# Altium project ZYNQ_JTY_16CH.PrjPcb (part 2 of 2)
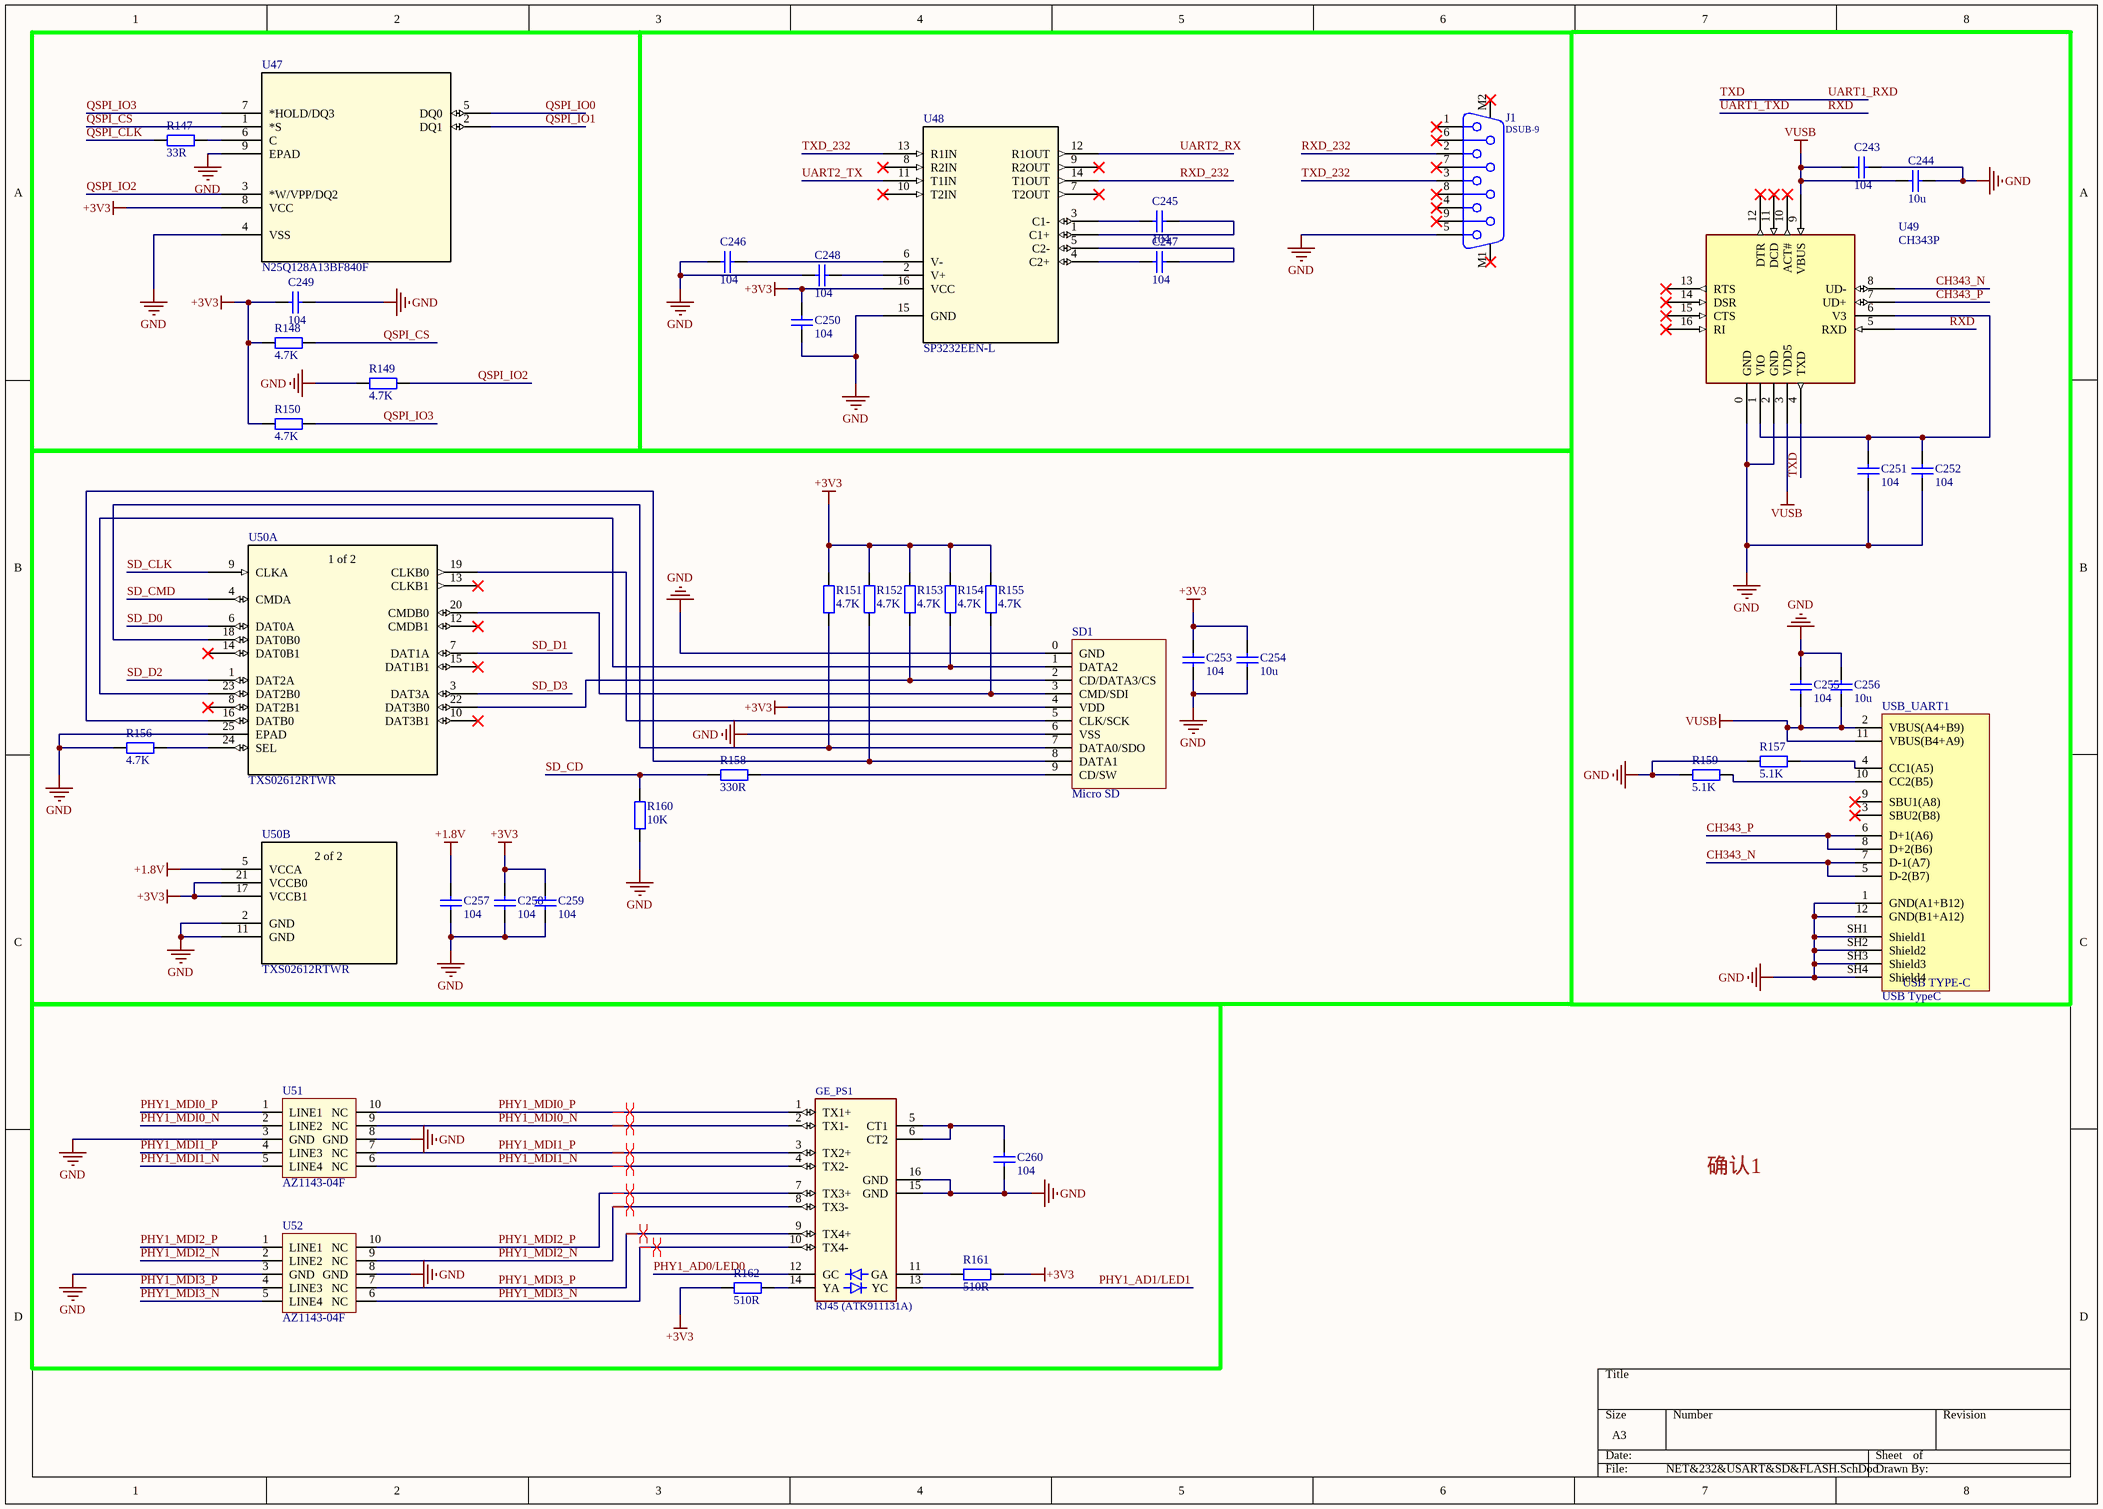
[diagram p13: NET&232&USART&SD&FLASH.SchDoc]

## Nets that join several sheets
+1.8V: PWR (C198.1 C201.2 R112.2 V2.5), USB_HOST (10 pins), NET&232&USART&SD&FLASH (C257.1 U50.5)
+3V3: CORE (R1.2 R2.2), PWR (6 pins), USB_HOST (C237.2 C238.2 R145.1 U45.21), NET&232&USART&SD&FLASH (20 pins)
+3V3_S7500: S7500_Drv (12 pins), PWR (5 pins)
+5_7020: CORE (8 pins), PWR (C204.2 C217.2 L4.2 R122.2), USB_HOST (C242.2 U46.5)
+5V_S7500: S7500_Drv (33 pins), PWR (5 pins)
+A3V3_PD: PD (54 pins), PWR (5 pins)
+A4_PD: PD (34 pins), PWR (C224.2 R131.2 V5.11)
+A5_PD: PD (15 pins), PWR (12 pins)
+D2V5_PD: PD (22 pins), PWR (C205.1 C208.2 R116.2 V4.5)
-5V_S7500: S7500_Drv (18 pins), PWR (7 pins)
-A4_PD: PD (51 pins), PWR (C225.1 R136.1 V5.6)
AGND1: PD (224 pins), PWR (19 pins)
AGND2: S7500_Drv (91 pins), PWR (58 pins)
GND: CORE (23 pins), S7500_Drv (R14.2), PD (R58.2), PWR (23 pins), USB_HOST (20 pins), NET&232&USART&SD&FLASH (44 pins)
/CS_GAIN: CORE (7020.J1_76), S7500_Drv (U10.21)
/CS_SOA: CORE (7020.J1_65), S7500_Drv (U13.21)
/RST_GAIN: CORE (7020.J1_74), S7500_Drv (U10.22)
/RST_SOA: CORE (7020.J1_86), S7500_Drv (U13.22)
CLKA: CORE (7020.J2_61), S7500_Drv (U1.26)
CLKB: CORE (7020.J2_26), S7500_Drv (U7.26)
CLKC: CORE (7020.J2_60), S7500_Drv (U4.26)
CNV9: CORE (7020.J1_46), PD (R53.6)
DB0A: CORE (7020.J2_29), S7500_Drv (U1.14)
DB0B: CORE (7020.J2_13), S7500_Drv (U7.14)
DB0C: CORE (7020.J2_32), S7500_Drv (U4.14)
DB1A: CORE (7020.J2_31), S7500_Drv (U1.13)
DB1B: CORE (7020.J2_15), S7500_Drv (U7.13)
DB1C: CORE (7020.J2_34), S7500_Drv (U4.13)
DB2A: CORE (7020.J2_33), S7500_Drv (U1.12)
DB2B: CORE (7020.J2_17), S7500_Drv (U7.12)
DB2C: CORE (7020.J2_36), S7500_Drv (U4.12)
DB3A: CORE (7020.J2_35), S7500_Drv (U1.11)
DB3B: CORE (7020.J2_19), S7500_Drv (U7.11)
DB3C: CORE (7020.J2_38), S7500_Drv (U4.11)
DB4A: CORE (7020.J2_37), S7500_Drv (U1.10)
DB4B: CORE (7020.J2_21), S7500_Drv (U7.10)
DB4C: CORE (7020.J2_40), S7500_Drv (U4.10)
DB5A: CORE (7020.J2_39), S7500_Drv (U1.9)
DB5B: CORE (7020.J2_23), S7500_Drv (U7.9)
DB5C: CORE (7020.J2_42), S7500_Drv (U4.9)
DB6A: CORE (7020.J2_41), S7500_Drv (U1.8)
DB6B: CORE (7020.J2_25), S7500_Drv (U7.8)
DB6C: CORE (7020.J2_44), S7500_Drv (U4.8)
DB7A: CORE (7020.J2_43), S7500_Drv (U1.7)
DB7B: CORE (7020.J2_27), S7500_Drv (U7.7)
DB7C: CORE (7020.J2_46), S7500_Drv (U4.7)
DB8A: CORE (7020.J2_45), S7500_Drv (U1.6)
DB8B: CORE (7020.J2_14), S7500_Drv (U7.6)
DB8C: CORE (7020.J2_48), S7500_Drv (U4.6)
DB9A: CORE (7020.J2_47), S7500_Drv (U1.5)
DB9B: CORE (7020.J2_16), S7500_Drv (U7.5)
DB9C: CORE (7020.J2_50), S7500_Drv (U4.5)
DB10A: CORE (7020.J2_49), S7500_Drv (U1.4)
DB10B: CORE (7020.J2_18), S7500_Drv (U7.4)
DB10C: CORE (7020.J2_52), S7500_Drv (U4.4)
DB11A: CORE (7020.J2_51), S7500_Drv (U1.3)
DB11B: CORE (7020.J2_20), S7500_Drv (U7.3)
DB11C: CORE (7020.J2_54), S7500_Drv (U4.3)
DB12A: CORE (7020.J2_53), S7500_Drv (U1.2)
DB12B: CORE (7020.J2_22), S7500_Drv (U7.2)
DB12C: CORE (7020.J2_56), S7500_Drv (U4.2)
DB13A: CORE (7020.J2_55), S7500_Drv (U1.1)
DB13B: CORE (7020.J2_24), S7500_Drv (U7.1)
DB13C: CORE (7020.J2_58), S7500_Drv (U4.1)
DB14A: CORE (7020.J2_57), S7500_Drv (U1.28)
DB14B: CORE (7020.J2_30), S7500_Drv (U7.28)
DB14C: CORE (7020.J1_61), S7500_Drv (U4.28)
DB15A: CORE (7020.J2_59), S7500_Drv (U1.27)
DB15B: CORE (7020.J2_28), S7500_Drv (U7.27)
DB15C: CORE (7020.J1_63), S7500_Drv (U4.27)
OTG_CLK: CORE (7020.J2_71), USB_HOST (R140.1)
OTG_DATA0: CORE (7020.J2_70), USB_HOST (U45.3)
OTG_DATA1: CORE (7020.J2_68), USB_HOST (U45.4)
OTG_DATA2: CORE (7020.J2_72), USB_HOST (U45.5)
OTG_DATA3: CORE (7020.J2_75), USB_HOST (U45.6)
OTG_DATA4: CORE (7020.J2_66), USB_HOST (U45.7)
OTG_DATA5: CORE (7020.J2_74), USB_HOST (U45.9)
OTG_DATA6: CORE (7020.J2_73), USB_HOST (U45.10)
OTG_DATA7: CORE (7020.J2_64), USB_HOST (U45.13)
OTG_DIR: CORE (7020.J2_69), USB_HOST (U45.31)
OTG_NXT: CORE (7020.J2_65), USB_HOST (U45.2)
OTG_RESETN: CORE (7020.J2_96), USB_HOST (C231.2 R142.1 U45.27)
OTG_STP: CORE (7020.J2_67), USB_HOST (U45.29)
PHY1_AD0/LED0: CORE (7020.J2_1), NET&232&USART&SD&FLASH (GE_PS1.12)
PHY1_AD1/LED1: CORE (7020.J2_2), NET&232&USART&SD&FLASH (GE_PS1.13)
PHY1_MDI0_N: CORE (7020.J2_5), NET&232&USART&SD&FLASH (GE_PS1.2 U51.2 U51.9)
PHY1_MDI0_P: CORE (7020.J2_3), NET&232&USART&SD&FLASH (GE_PS1.1 U51.1 U51.10)
PHY1_MDI1_N: CORE (7020.J2_9), NET&232&USART&SD&FLASH (GE_PS1.4 U51.5 U51.6)
PHY1_MDI1_P: CORE (7020.J2_7), NET&232&USART&SD&FLASH (GE_PS1.3 U51.4 U51.7)
PHY1_MDI2_N: CORE (7020.J2_6), NET&232&USART&SD&FLASH (GE_PS1.8 U52.2 U52.9)
PHY1_MDI2_P: CORE (7020.J2_4), NET&232&USART&SD&FLASH (GE_PS1.7 U52.1 U52.10)
PHY1_MDI3_N: CORE (7020.J2_10), NET&232&USART&SD&FLASH (GE_PS1.10 U52.5 U52.6)
PHY1_MDI3_P: CORE (7020.J2_8), NET&232&USART&SD&FLASH (GE_PS1.9 U52.4 U52.7)
QSPI_CLK: CORE (7020.J1_71), NET&232&USART&SD&FLASH (R147.2)
QSPI_CS: CORE (7020.J1_79), NET&232&USART&SD&FLASH (R148.1 U47.1)
QSPI_IO0: CORE (7020.J1_73), NET&232&USART&SD&FLASH (U47.5)
QSPI_IO1: CORE (7020.J1_77), NET&232&USART&SD&FLASH (U47.2)
RXD: CORE (7020.J2_87), NET&232&USART&SD&FLASH (U49.5)
SCK9: CORE (7020.J1_50), PD (R53.8)
SCLK_GAIN: CORE (7020.J1_78), S7500_Drv (U10.20)
SCLK_SOA: CORE (7020.J1_67), S7500_Drv (U13.20)
SD_CD: CORE (7020.J2_91), NET&232&USART&SD&FLASH (R158.2 R160.1)
SD_CLK: CORE (7020.J2_80), NET&232&USART&SD&FLASH (U50.9)
SD_CMD: CORE (7020.J2_78), NET&232&USART&SD&FLASH (U50.4)
SD_D0: CORE (7020.J2_82), NET&232&USART&SD&FLASH (U50.6)
SD_D1: CORE (7020.J2_84), NET&232&USART&SD&FLASH (U50.7)
SD_D2: CORE (7020.J2_86), NET&232&USART&SD&FLASH (U50.1)
SD_D3: CORE (7020.J2_88), NET&232&USART&SD&FLASH (U50.3)
SDI_GAIN: CORE (7020.J1_80), S7500_Drv (U10.19)
SDI_SOA: CORE (7020.J1_69), S7500_Drv (U13.19)
SDO9: CORE (7020.J1_48), PD (R53.7)
TXD: CORE (7020.J2_89), NET&232&USART&SD&FLASH (U49.4)
UART2_RX: CORE (7020.J1_88), NET&232&USART&SD&FLASH (U48.12)
UART2_TX: CORE (7020.J1_90), NET&232&USART&SD&FLASH (U48.11)
W_CLKOUT: CORE (7020.J1_39), PD (R59.5)
W_CNV: CORE (7020.J1_33), PD (R60.6)
W_SCK: CORE (7020.J1_49), PD (R59.8)
W_SDO1: CORE (7020.J1_35), PD (R60.7)
W_SDO2: CORE (7020.J1_37), PD (R60.8)
W_SDO3: CORE (7020.J1_45), PD (R59.6)
W_SDO4: CORE (7020.J1_47), PD (R59.7)
X_CLKOUT: CORE (7020.J1_21), PD (R51.5)
X_CNV: CORE (7020.J1_11), PD (R52.6)
X_SCK: CORE (7020.J1_27), PD (R51.8)
X_SDO1: CORE (7020.J1_13), PD (R52.7)
X_SDO2: CORE (7020.J1_15), PD (R52.8)
X_SDO3: CORE (7020.J1_23), PD (R51.6)
X_SDO4: CORE (7020.J1_25), PD (R51.7)
Y_CLKOUT: CORE (7020.J1_18), PD (R54.5)
Y_CNV: CORE (7020.J1_12), PD (R55.6)
Y_SCK: CORE (7020.J1_26), PD (R54.8)
Y_SDO1: CORE (7020.J1_14), PD (R55.7)
Y_SDO2: CORE (7020.J1_16), PD (R55.8)
Y_SDO3: CORE (7020.J1_20), PD (R54.6)
Y_SDO4: CORE (7020.J1_22), PD (R54.7)
Z_CLKOUT: CORE (7020.J1_36), PD (R56.5)
Z_CNV: CORE (7020.J1_28), PD (R57.6)
Z_SCK: CORE (7020.J1_44), PD (R56.8)
Z_SDO1: CORE (7020.J1_30), PD (R57.7)
Z_SDO2: CORE (7020.J1_32), PD (R57.8)
Z_SDO3: CORE (7020.J1_38), PD (R56.6)
Z_SDO4: CORE (7020.J1_40), PD (R56.7)